# Altium project led7SegDriverWithPS.PrjPcb
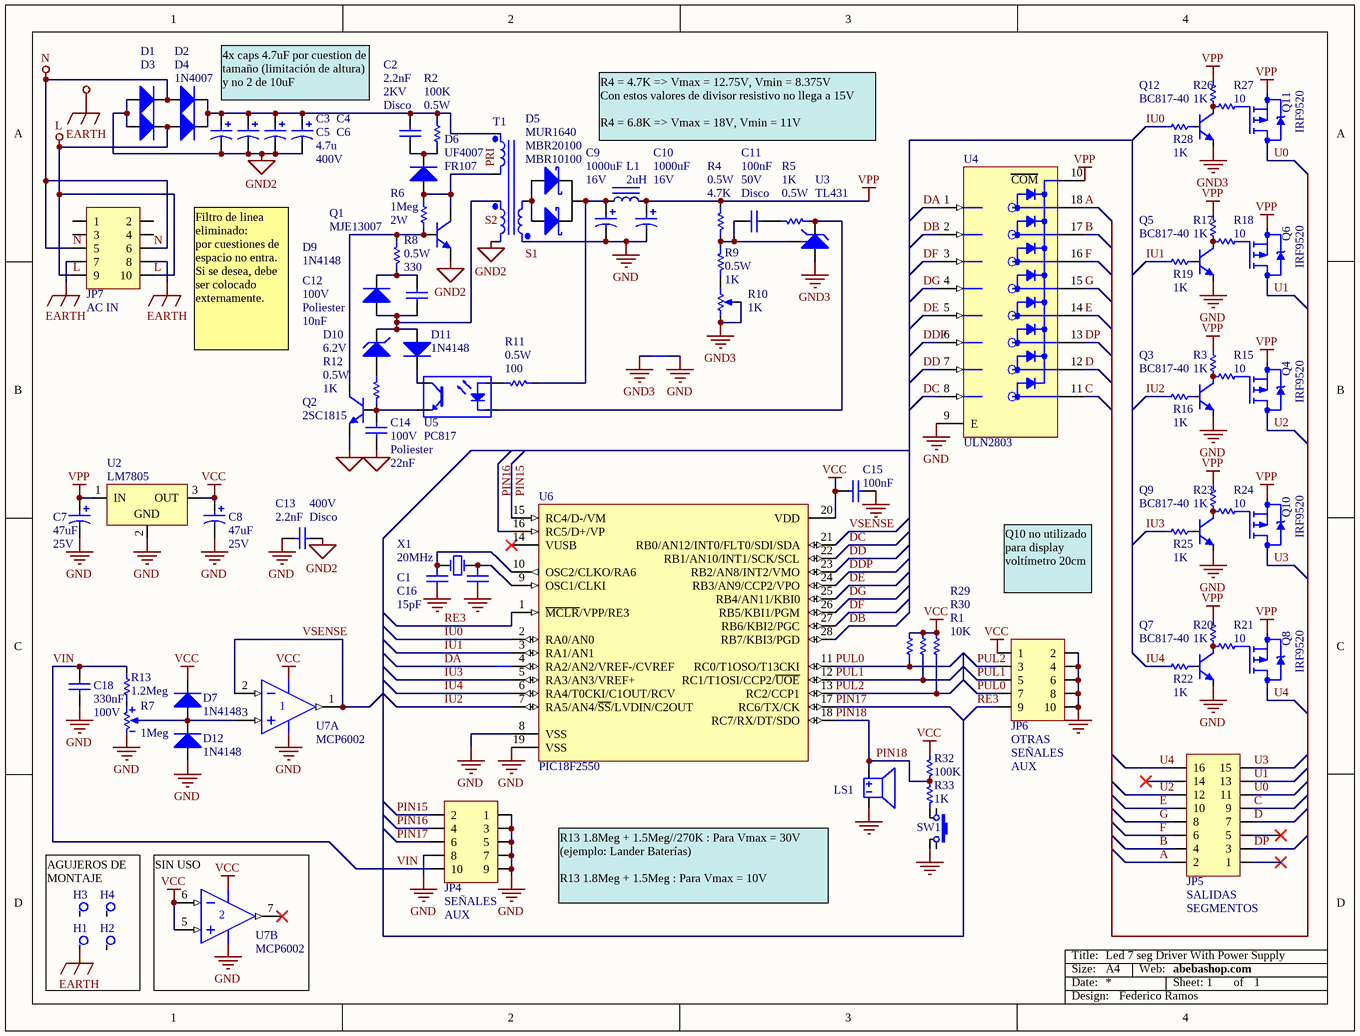
[diagram p0: led7SegDriverWithPS.SchDoc]
1 sheet, 93 parts. Net scope: global (net labels, ports and power ports of the same name join across sheets).
Board file: led7SegDriverWithPS.PcbDoc

## Sheet led7SegDriverWithPS.SchDoc
size 254 x 193 mm; PageSetup: Record=PageOptions|CenterHorizontal=True|CenterVertical=True|PrintScale=1.08|XCorrection=1.00|YCorrection=1.00|PrintKind=0|BorderSize=5000000|LeftOffset=0|BottomOffset=0|Orientation=2|PaperLength=1000|PaperWidth=1000|Scale=100|PaperSource=7|PrintQuality=-4|MediaType=1|DitherType=10|PaperKind=Letter|PrintScaleMode=1

### Parts
C1  value 15pF  [c1206]  (hidden comment: Cap)
C2  value 2.2nF  Voltage: 2KV  Technology: Disco  [CAP200th]  (hidden comment: Cap)
C3  value 4.7u  Voltaje: 400V  [C_EL_10X12.5]  (hidden comment: Cap Pol)
C4  Cap Pol  [C_EL_10X12.5]  (value not drawn)
C5  Cap Pol  [C_EL_10X12.5]  (value not drawn)
C6  Cap Pol  [C_EL_10X12.5]  (value not drawn)
C7  value 47uF  Voltaje: 25V  [C_EL_6-3X11]  (hidden comment: Cap Pol)
C8  value 47uF  Voltaje: 25V  [C_EL_6-3X11]  (hidden comment: Cap Pol)
C9  value 1000uF  Voltaje: 16V  [C_EL_10X12.5]  (hidden comment: Cap Pol)
C10  value 1000uF  Voltaje: 16V  [C_EL_10X12.5]  (hidden comment: Cap Pol)
C11  value 100nF  Voltage: 50V  Technology: Disco  [C1206]  (hidden comment: Cap)
C12  value 10nF  Voltage: 100V  Technology: Poliester  [CAP200th]  (hidden comment: Cap)
C13  value 2.2nF  Voltage: 400V  Technology: Disco  [CAP200th]  (hidden comment: Cap)
C14  value 22nF  Voltage: 100V  Technology: Poliester  [CAP200th]  (hidden comment: Cap)
C15  value 100nF  [1206NP]  (hidden comment: Cap)
C16  Cap  [c1206]  (value not drawn)
C18  value 330nF  Voltage: 100V  [1206NP]  (hidden comment: Cap)
D1  1N4007  [D_DO41]
D2  1N4007  [D_DO41]  (value not drawn)
D3  1N4007  [D_DO41]  (value not drawn)
D4  1N4007  [D_DO41]  (value not drawn)
D5  MBR20100  [TO220]
D6  UF4007  alternativa: FR107  [D_DO41]
D7  1N4148  [DSMD1MM]
D9  1N4148  [DIODE300]
D10  VOLTAJE: 6.2V  [D_DO41]  (hidden comment: Zener)
D11  1N4148  [D_DO41]
D12  1N4148  [DSMD1MM]
H1  Agujero de montaje  [agujero]  (value not drawn)
H2  Agujero de montaje  [agujero]  (value not drawn)
H3  Agujero de montaje  [agujero]  (value not drawn)
H4  Agujero de montaje  [agujero]  (value not drawn)
JP4  Price: SEÑALES  [idc5x2]  (hidden comment: IDC 5x2)
JP5  Header8x2  [idc8x2]  (value not drawn)
JP6  IDC 5x2  [idc5x2]  (value not drawn)
JP7  IDC 5x2  [idc5x2]  (value not drawn)
L1  value 2uH  [IND0810]  (hidden comment: Inductor)
LS1  Buzzer  [buzzer12mm]  (value not drawn)
Q1  MJE13007  [TO220]
Q2  2SC1815  [to92]
Q3  BC817-40  [SOT23]
Q4  IRF9520  [TO220]
Q5  BC817-40  [SOT23]
Q6  IRF9520  [TO220]
Q7  BC817-40  [SOT23]
Q8  IRF9520  [TO220]
Q9  BC817-40  [SOT23]
Q10  IRF9520  [TO220]
Q11  IRF9520  [TO220]
Q12  BC817-40  [SOT23]
R1  Resistencia: 10K  [R1206]  (hidden comment: Resistencia 1206; 10Kohm)
R2  value 100K  Power: 0.5W  [RES300TH]  (hidden comment: Res)
R3  Resistencia: 1K  [R1206]  (hidden comment: Resistencia 1206; 1Kohm)
R4  value 4.7K  Power: 0.5W  [RES300TH]  (hidden comment: Res)
R5  value 1K  Power: 0.5W  [R1206]  (hidden comment: Res)
R6  value 1Meg  Power: 2W  [res400th]  (hidden comment: Res)
R7  value 1Meg  [PRESET]  (hidden comment: Preset)
R8  value 330  Power: 0.5W  [RES300TH]  (hidden comment: Res)
R9  value 1K  Power: 0.5W  [R1206]  (hidden comment: Res)
R10  value 1K  [Preset6]  (hidden comment: RVar)
R11  value 100  Power: 0.5W  [RES300TH]  (hidden comment: Res)
R12  value 1K  Power: 0.5W  [RES300TH]  (hidden comment: Res)
R13  value 1.2Meg  [1206NP]  (hidden comment: Res)
R14  Resistencia 1206; 0ohm  [R1206]  (value not drawn)
R15  Resistencia: 10  [R1206]  (hidden comment: Resistencia 1206; 10ohm)
R16  Resistencia: 1K  [res300th]  (hidden comment: Resistencia 1206; 1Kohm)
R17  Resistencia: 1K  [R1206]  (hidden comment: Resistencia 1206; 1Kohm)
R18  Resistencia: 10  [R1206]  (hidden comment: Resistencia 1206; 10ohm)
R19  Resistencia: 1K  [res300th]  (hidden comment: Resistencia 1206; 1Kohm)
R20  Resistencia: 1K  [R1206]  (hidden comment: Resistencia 1206; 1Kohm)
R21  Resistencia: 10  [R1206]  (hidden comment: Resistencia 1206; 10ohm)
R22  Resistencia: 1K  [res300th]  (hidden comment: Resistencia 1206; 1Kohm)
R23  Resistencia: 1K  [R1206]  (hidden comment: Resistencia 1206; 1Kohm)
R24  Resistencia: 10  [R1206]  (hidden comment: Resistencia 1206; 10ohm)
R25  Resistencia: 1K  [res300th]  (hidden comment: Resistencia 1206; 1Kohm)
R26  Resistencia: 1K  [R1206]  (hidden comment: Resistencia 1206; 1Kohm)
R27  Resistencia: 10  [R1206]  (hidden comment: Resistencia 1206; 10ohm)
R28  Resistencia: 1K  [res300th]  (hidden comment: Resistencia 1206; 1Kohm)
R29  Resistencia 1206; 10Kohm  [R1206]  (value not drawn)
R30  Resistencia 1206; 10Kohm  [R1206]  (value not drawn)
R32  Resistencia: 100K  [R1206]  (hidden comment: Resistencia 1206; 10Kohm)
R33  Resistencia: 1K  [R1206]  (hidden comment: Resistencia 1206; 10Kohm)
ROT?  ROTULO  (value not drawn)  (graphical)
SW1  SW_T_5MM  [SW_T_5MM]  (value not drawn)
T1  Transformer 2  [COSMO - EE 2507]  (value not drawn)
U2  LM7805  [TO220]
U3  TL431  [TO92]
U4  ULN2803  [DIP18Z]
U5  PC817  [DIP4]
U6  PIC18F2550  [DIP28Z 300MILS]
U7  MCP6002  [dip8z]  (parts A,B of 2)
W1  CABLE  [1206NP]  (value not drawn)
X1  value 20MHz  [HC49S]  (hidden comment: XTAL)

### Nets
EARTH: H1.1 JP7.7 JP7.8
GND: C1.1 C7.2 C8.2 C9.2 C10.2 C13.2 C15.2 C16.1 C18.1 D12.1 JP4.1 JP4.3 JP4.5 JP4.7 JP4.8 JP4.9 JP6.2 JP6.4 JP6.6 JP6.8 JP6.10 LS1.2 Q3.2(E) Q5.2(E) Q7.2(E) Q9.2(E) R7.3 R14.2 SW1.2 T1.1 U2.2(GND) U4.9(E) U6.8(VSS) U6.19(VSS) U7.4(V-)
GND2: C3.2 C4.2 C5.2 C6.2 C13.1 C14.1 D1.1 D2.1 Q1.3(E) Q2.1(E) T1.4
GND3: Q12.2(E) R10.1 R10.3 R14.1 U3.2(A)
L: D2.2 D4.1 JP7.9 JP7.10
N: D1.2 D3.1 JP7.5 JP7.6
VCC: C8.1 C15.1 D7.2 JP6.1 R1.2 R29.2 R30.2 R32.2 U2.3(OUT) U6.20(VDD) U7.5(IN+) U7.6(IN-) U7.8(V+)
VPP: C7.1 C10.1 L1.2 Q4.3(S) Q6.3(S) Q8.3(S) Q10.3(S) Q11.3(S) R3.2 R4.1 R17.2 R20.2 R23.2 R26.2 U2.1(IN) U4.10(~{COM})
A: JP5.2 U4.18(~{C}1)
B: JP5.4 U4.17(~{C}2)
C: JP5.9 U4.11(~{C}8)
D: JP5.7 U4.12(~{C}7)
DA: U4.1(B1) W1.1
DB: U4.2(B2) U6.28(RB7/KBI3/PGD)
DC: U4.8(B8) U6.22(RB1/AN10/INT1/SCK/SCL)
DD: U4.7(B7) U6.23(RB2/AN8/INT2/VMO)
DDP: U4.6(B6) U6.24(RB3/AN9/CCP2/VPO)
DE: U4.5(B5) U6.25(RB4/AN11/KBI0)
DF: U4.3(B3) U6.27(RB6/KBI2/PGC)
DG: U4.4(B4) U6.26(RB5/KBI1/PGM)
DP: JP5.3 U4.13(~{C}6)
E: JP5.10 U4.14(~{C}5)
F: JP5.6 U4.16(~{C}3)
G: JP5.8 U4.15(~{C}4)
IU0: R28.1 U6.2(RA0/AN0)
IU1: R19.1 U6.3(RA1/AN1)
IU2: R16.1 U6.7(RA5/AN4/~{SS}/LVDIN/C2OUT)
IU3: R25.1 U6.5(RA3/AN3/VREF+)
IU4: R22.1 U6.6(RA4/T0CKI/C1OUT/RCV)
PIN15: JP4.2 U6.15(RC4/D-/VM)
PIN16: JP4.4 U6.16(RC5/D+/VP)
PIN17: JP4.6 U6.17(RC6/TX/CK)
PIN18: LS1.1 R32.1 R33.2 U6.18(RC7/RX/DT/SDO)
PUL0: JP6.7 R29.1 U6.11(RC0/T1OSO/T13CKI)
PUL1: JP6.5 R30.1 U6.12(RC1/T1OSI/CCP2/~{UOE})
PUL2: JP6.3 R1.1 U6.13(RC2/CCP1)
RE3: JP6.9 U6.1(~{MCLR}/VPP/RE3)
U0: JP5.11 Q11.2(D)
U1: JP5.13 Q6.2(D)
U2: JP5.12 Q4.2(D)
U3: JP5.15 Q10.2(D)
U4: JP5.16 Q8.2(D)
VIN: C18.2 JP4.10 R13.2
VSENSE: U6.21(RB0/AN12/INT0/FLT0/SDI/SDA) U7.1(OUT) U7.2(IN-)
NetC1_2: C1.2 U6.10(OSC2/CLKO/RA6) X1.1(OSC1)
NetC2_1: C2.1 D6.2 R2.2
NetC2_2: C2.2 C3.1 C4.1 C5.1 C6.1 D3.2 D4.2 R2.1 T1.5
NetC9_1: C9.1 D5.2(K) L1.1 R11.1
NetC11_1: C11.1 R5.1
NetC11_2: C11.2 R4.2 R9.1 U3.3(REF)
NetC12_1: C12.1 D9.1 D10.2(K) D11.1 T1.3
NetC12_2: C12.2 D9.2 R8.1
NetC14_2: C14.2 Q2.3(B) R12.1 U5.3(E)
NetC16_2: C16.2 U6.9(OSC1/CLKI) X1.2(OSC2)
NetD5_1: D5.1(A) D5.3(A) T1.2
NetD6_1: D6.1 Q1.1(C) R6.1 T1.6
NetD7_1: D7.1 D12.2 R7.2 U7.3(IN+)
NetD10_1: D10.1(A) R12.2
NetD11_2: D11.2 U5.4(C)
NetQ1_2: Q1.2(B) Q2.2(C) R6.2 R8.2
NetQ3_1: Q3.1(B) R16.2
NetQ3_3: Q3.3(C) R3.1 R15.1
NetQ4_1: Q4.1(G) R15.2
NetQ5_1: Q5.1(B) R19.2
NetQ5_3: Q5.3(C) R17.1 R18.1
NetQ6_1: Q6.1(G) R18.2
NetQ7_1: Q7.1(B) R22.2
NetQ7_3: Q7.3(C) R20.1 R21.1
NetQ8_1: Q8.1(G) R21.2
NetQ9_1: Q9.1(B) R25.2
NetQ9_3: Q9.3(C) R23.1 R24.1
NetQ10_1: Q10.1(G) R24.2
NetQ11_1: Q11.1(G) R27.2
NetQ12_1: Q12.1(B) R28.2
NetQ12_3: Q12.3(C) R26.1 R27.1
NetR5_2: R5.2 U3.1(K) U5.2(K)
NetR7_1: R7.1 R13.1
NetR9_2: R9.2 R10.2
NetR11_2: R11.2 U5.1(A)
NetR33_1: R33.1 SW1.1
NetU6_4: U6.4(RA2/AN2/VREF-/CVREF) W1.2

Not connected (* = marked no-connect by the designer): H2 1; H3 1; H4 1; JP5 1* 5* 14*; JP7 1 2 3 4; SW1 3 4; U6 14(VUSB)*; U7 7(OUT)*

### Notes on the sheet
- 4x caps 4.7uF por cuestion de tamaño (limitación de altura) y no 2 de 10uF
- R4 = 4.7K => Vmax = 12.75V, Vmin = 8.375V
  Con estos valores de divisor resistivo no llega a 15V
  R4 = 6.8K => Vmax = 18V, Vmin = 11V
- Filtro de linea eliminado:
  por cuestiones de espacio no entra.
  Si se desea, debe ser colocado externamente.
- Q10 no utilizado para display voltímetro 20cm
- R13 1.8Meg + 1.5Meg//270K : Para Vmax = 30V (ejemplo: Lander Baterías)
  R13 1.8Meg + 1.5Meg : Para Vmax = 10V
- AGUJEROS DE MONTAJE
- (near U7) SIN USO
- (near ROT?) Led 7 seg Driver With Power Supply
- abebashop.com
- 1
- Federico Ramos
- Labels drawn without touching a wire or pin: PRI, S1, S2
- (in symbol Header8x2) SALIDAS; SEGMENTOS
- (in symbol IDC 5x2) AUX; AC IN; OTRAS; SEÑALES
- (in symbol MBR10100) MUR1640
- (in symbol ROTULO) Title:; Size:; A4; Web:; Date:; Sheet:; of; Design:
- (in symbol ULN2803) COM

### Library data of the parts
C1 C15 = Cap: Capacitor; Voltage: 50V; Price: 0.25; Technology: Ceramic
C2 C11-C14 C18 = Cap: Capacitor; Price: 0.25
  C18: Technology: Ceramic
C3 C7-C10 = Cap Pol: Capacitor Polarizado; Price: ?
C4-C6 = Cap Pol: Capacitor Polarizado; Value: 4.7uF; Voltaje: 400V; Price: ?
C16 = Cap: Capacitor; Voltage: 50V; Value: 100nF; Price: 0.25; Technology: Ceramic
D1-D4 D6 = 1N4007: 1A 1000V General Purpose Rectifier; Price: ?
D5 = MBR10100: Schottky Diode 10A 45V; Revision: July-2002: Re-released for DXP Platform.; Comment2: MBR10100
D7 D9 D11 D12 = 1N4148: High Conductance Fast Diode; Price: ?
D10 = Zener: Zener Diode; Price: ?
JP5 = Header8x2: Header 8x2; Price: ?
Q1 = TIP41C: 6A 100V NPN Bipolar Transistor; pin to pad: 1>2 2>1; Price: 0.38
Q2 = 2SC1815: NPN Bipolar Transistor; Price: ?
Q3 Q5 Q7 Q9 Q12 = BC817-40: Dolares Elemon: 0.03755; Codigo Elemon: TR1723021
Q4 Q6 Q8 Q10 Q11 = IRF9530: 100V  12A 0.3 ohm Power Field Effect Transistor; Revision: 17-Jul-2002: Re-released for DXP Platform.
R1 R32 R33 = Resistencia 1206; 10Kohm: Codigo Elemon: RS3886245; Dolares Elemon: 0.00718
R2 R4-R6 R8 R9 R11 R12 = Res: Resistor; Price: 0.036
R3 R16 R17 R19 R20 R22 R23 R25 R26 R28 = Resistencia 1206; 1Kohm: Codigo Elemon: RS3886185; Dolares Elemon: 0.00720
R7 = Preset: Resistencia Variable
R10 = RVar: Resistencia Variable; pin to pad: 2>3 3>2; Set Position: 0,5; Price: ?
R13 = Res: Resistor; Power: 0.25W; Price: 0.036
R14 = Resistencia 1206; 0ohm: Codigo Elemon: RS3885900; Dolares Elemon: 0.00720
R15 R18 R21 R24 R27 = Resistencia 1206; 10ohm: Codigo Elemon: RS3886070; Dolares Elemon: 0.00717
R29 R30 = Resistencia 1206; 10Kohm: Codigo Elemon: RS3886245; Dolares Elemon: 0.00718; Resistencia: 10K
T1 = Transformer 2: Three-winding Transformer; Revision: July-2002: Re-released for DXP Platform.; Publisher: Altium Limited
U2 = LM78XX (v1): 3-Terminal Positive Regulator; Price: ?
U3 = TL431: Adjustable Zener Diode; pin to pad: 1>3 3>1; Price: ?
U4 = ULN2803: Darlington Transistor Array; Price: 1.40
U5 = PC817: Optoaislador; Price: ?
U6 = PIC18F2550: Enhanced FLASH Microcontroller
U7 = MCP6002: 1 MHz Bandwidth Low Power Op Amp
X1 = XTAL: Crystal Oscillator; Price: ?
JP4 JP6 JP7 = IDC 5x2
  JP6 JP7: Price: ?
L1 = Inductor: Revision: July-2002: Re-released for DXP Platform.
LS1 = Buzzer: Price: ?
SW1 = SW_T_5MM: Price: ?